# EAGLE design sensors (EAGLE 7.6.0)
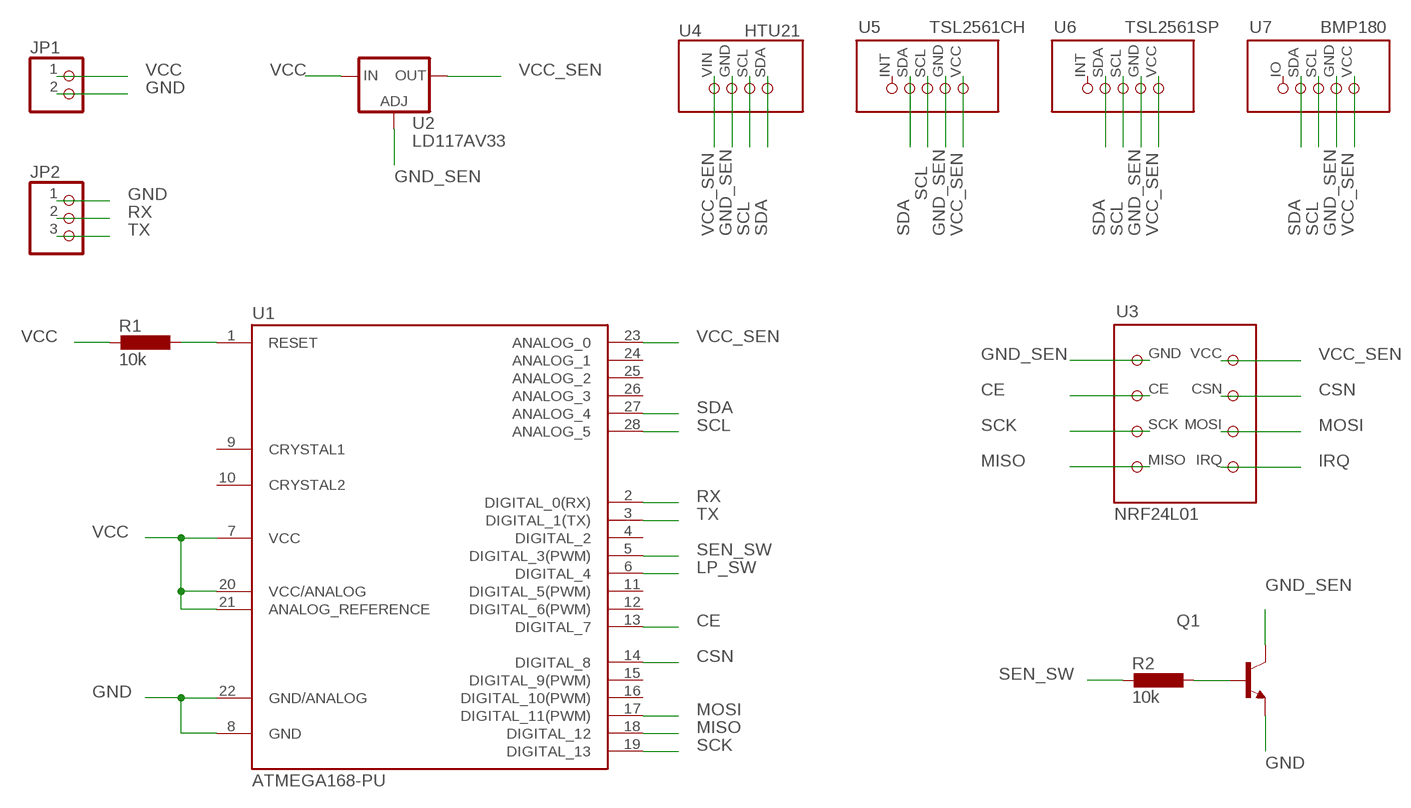
[diagram p0: schematic, sheet 1]

## Parts
JP1  PINHD-1X2  [1X02]
JP2  PINHD-1X3  [1X03]
Q1  -NPN-TO92-EBC  [TO92-EBC]
R1  10k  L-EU0207/10  [0207/10]
R2  10k  L-EU0207/10  [0207/10]
U1  ATMEGA168-PU  [DIL28-3]
U2  LD117AV33  [TO220L1]
U3  NRF24L01  [NRF24L01]
U4  HTU21  [HTU21]
U5  TSL2561CH  [TSL2561-CH]
U6  TSL2561SP  [TSL2561-SP]
U7  BMP180  [BMP180]

## Nets
CE: U1.13(DIGITAL_7) U3.CE
CSN: U1.14(DIGITAL_8) U3.CSN
GND: JP1.2 JP2.1 Q1.E U1.8(GND) U1.22(GND/ANALOG)
GND_SEN: Q1.C U2.1(ADJ) U3.GND U4.GND U5.GND U6.GND U7.GND
IRQ: U3.IRQ
LP_SW: U1.6(DIGITAL_4)
MISO: U1.18(DIGITAL_12) U3.MISO
MOSI: U1.17(DIGITAL_11(PWM)) U3.MOSI
N$1: R1.1 U1.1(RESET)
N$5: Q1.B R2.1
RX: JP2.2 U1.2(DIGITAL_0(RX))
SCK: U1.19(DIGITAL_13) U3.SCK
SCL: U1.28(ANALOG_5) U4.SCL U5.SCL U6.SCL U7.SCL
SDA: U1.27(ANALOG_4) U4.SDA U5.SDA U6.SDA U7.SDA
SEN_SW: R2.2 U1.5(DIGITAL_3(PWM))
TX: JP2.3 U1.3(DIGITAL_1(TX))
VCC: JP1.1 R1.2 U1.7(VCC) U1.20(VCC/ANALOG) U1.21(ANALOG_REFERENCE) U2.3(IN)
VCC_SEN: U1.23(ANALOG_0) U2.2(OUT) U3.VCC U4.VIN U5.VCC U6.VCC U7.VCC
Unconnected: U1.4(DIGITAL_2) U1.9(CRYSTAL1) U1.10(CRYSTAL2) U1.11(DIGITAL_5(PWM)) U1.12(DIGITAL_6(PWM)) U1.15(DIGITAL_9(PWM)) U1.16(DIGITAL_10(PWM)) U1.24(ANALOG_1) U1.25(ANALOG_2) U1.26(ANALOG_3) U5.INT U6.INT U7.IO(INT)

## Library data of the parts
JP1 = pinhead:PINHD-1X2: PIN HEADER
JP2 = pinhead:PINHD-1X3: PIN HEADER
Q1 = transistor:*-NPN-: NPN Transistror BF959 corrected 2008.03.06
R1 R2 = resistor:L-EU: INDUCTOR, European symbol
U1 = Arduino-AVR:ATMEGA168-PU
U2 = v-reg:LD117A?*: Low drop fixed and adjustable positive voltage regulators 1 A Source: http://www.st.com/stonline/products/literature/ds/7194/ld1117axx.pdf
U3 = sencast:NRF24L01
U4 = sencast:HTU21
U5 U6 = sencast:TSL2561
U7 = sencast:BMP180

## Board
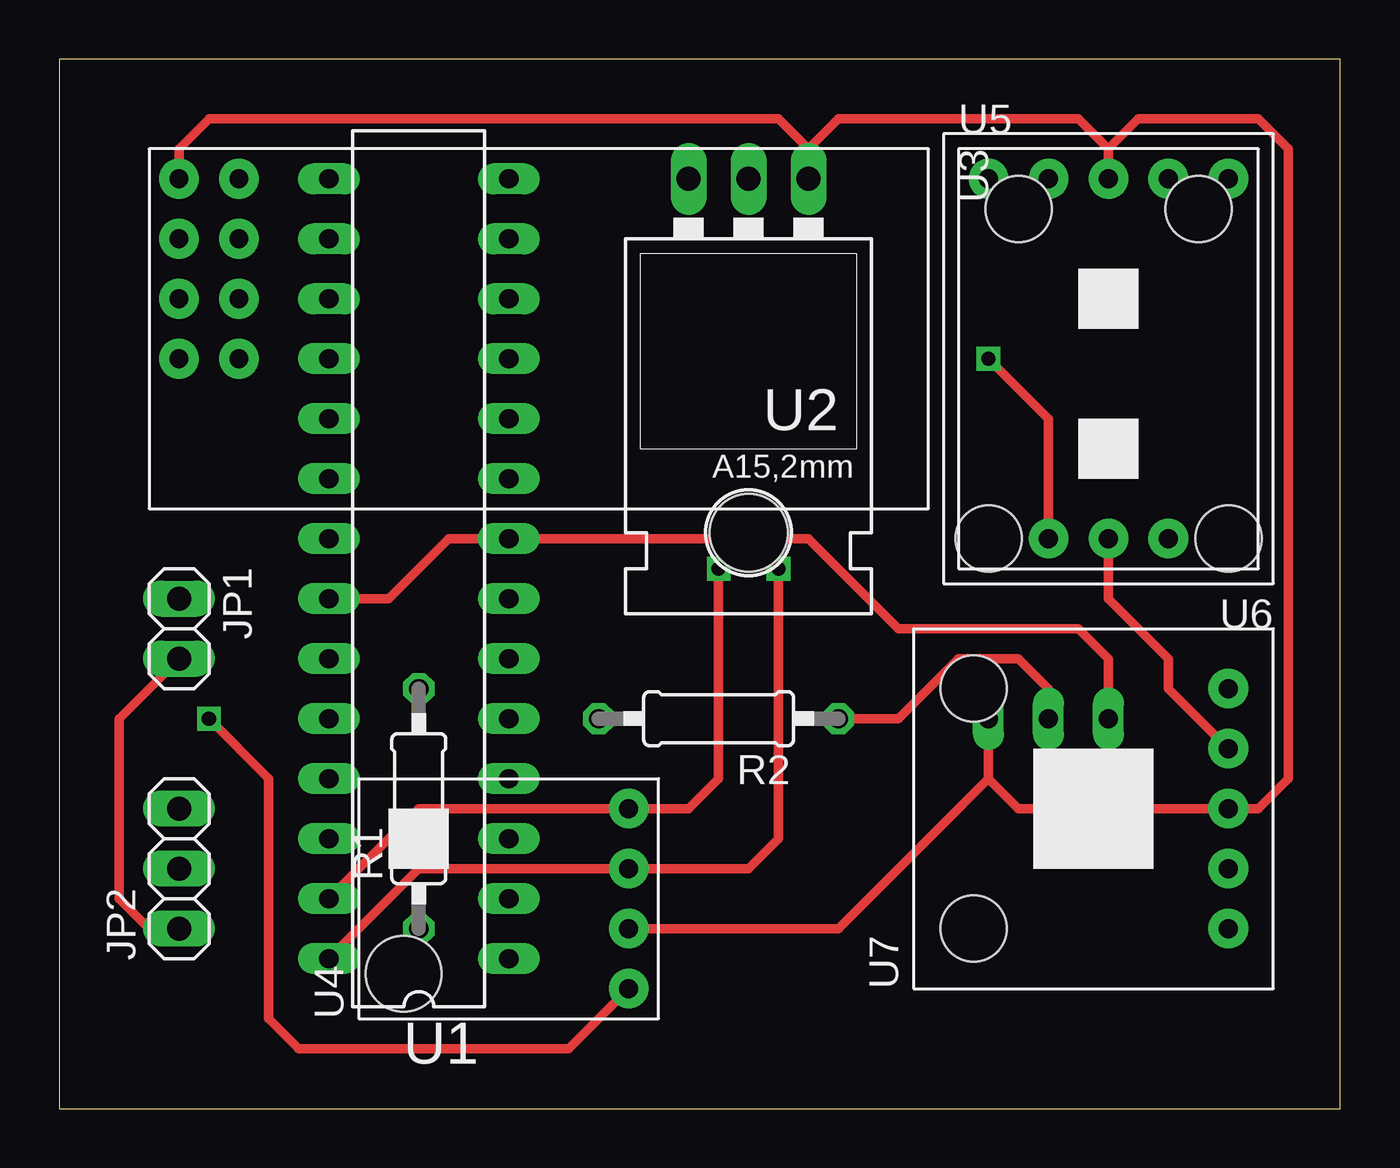
[diagram p1: board, top side]
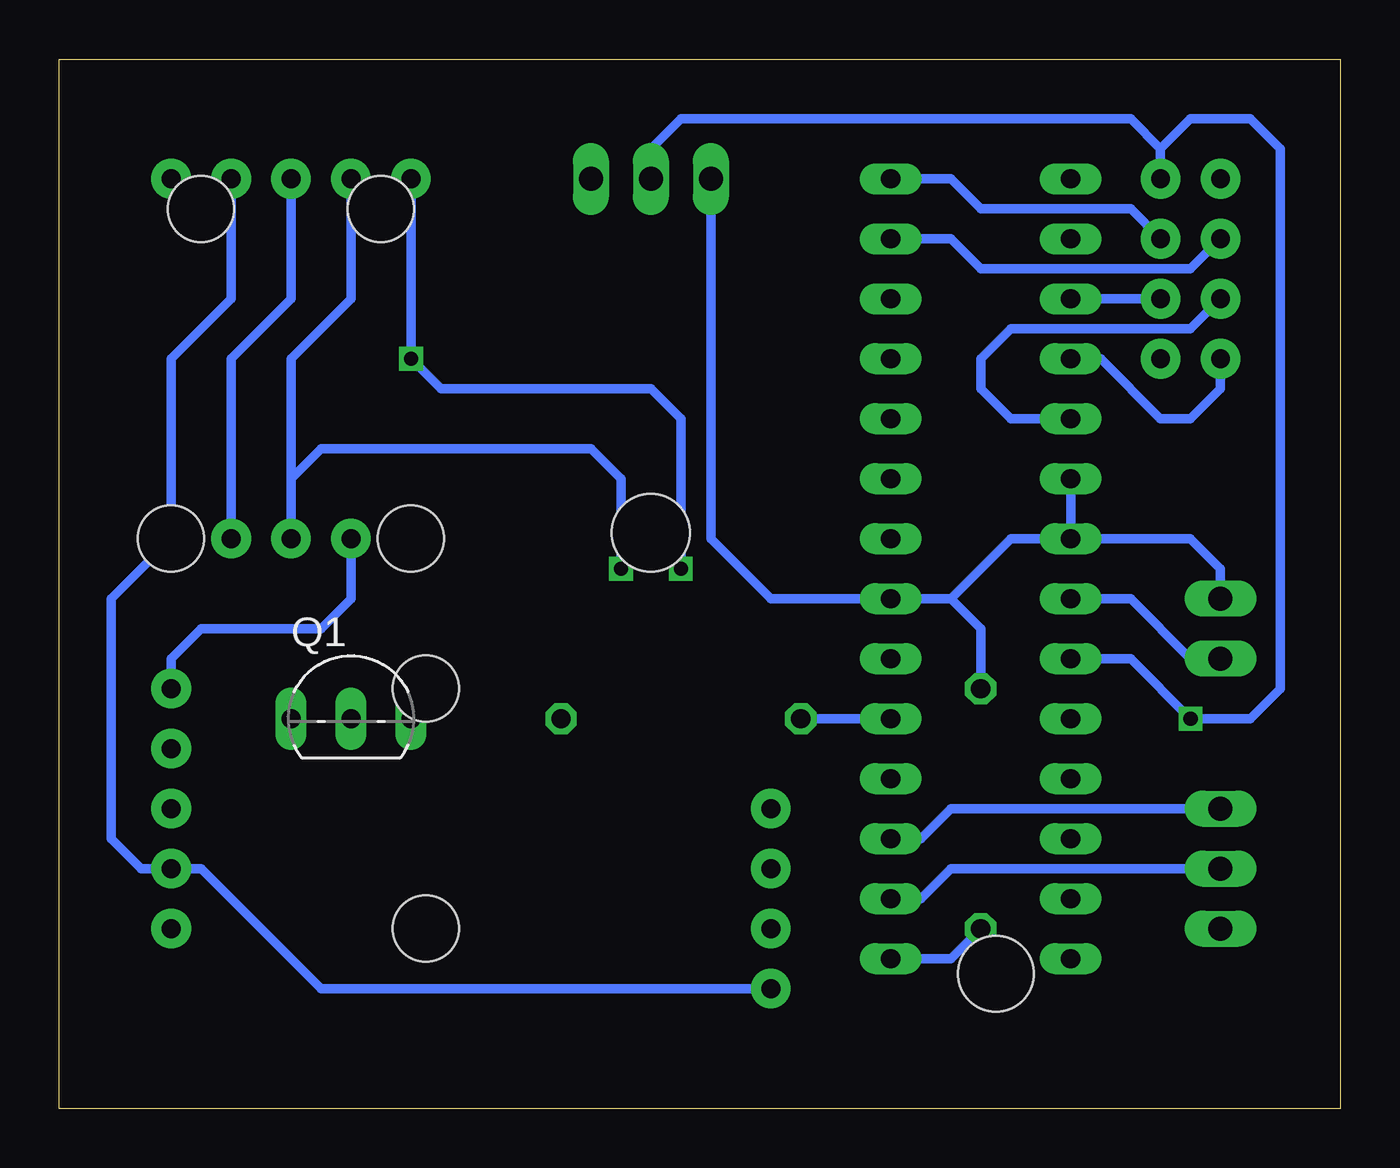
[diagram p2: board, bottom side, seen from below]

Size 54.28 x 44.44 mm. Coordinates in mm from the lower left corner, seen from the top.
Outline: 0,0 54.28,0 54.28,44.44 0,44.44 0,0
Copper layers (1*16): Top 0.035mm / dielectric 1.5mm / Bottom 0.035mm
Design rules "default": minimum track width 10mil, minimum drill 24mil, track to track 8mil, track to pad 8mil, pad to pad 8mil, via to via 8mil, smd to smd 8mil, copper to edge 40mil, drill to drill 8mil, minimum pad ring 10mil, minimum via ring 8mil, stop-mask expansion 4mil, vias tented up to drill 0mil, thermal gap 10mil

### Footprints (pad centres in the part's own frame; a part is rotated, then mirrored left to right if it is on the bottom)
1X02 = drill 1.016 long: 1 -1.27,0; 2 1.27,0
1X03 = drill 1.016 long: 1 -2.54,0; 2 0,0; 3 2.54,0
TO92-EBC = drill 0.813 long: B 0,-1.27; C 2.54,-1.27; E -2.54,-1.27
0207/10 = drill 0.813 octagon: 1 -5.08,0; 2 5.08,0
DIL28-3 = drill 0.813 long: 1 -16.51,-3.81; 2 -13.97,-3.81; 3 -11.43,-3.81; 4 -8.89,-3.81; 5 -6.35,-3.81; 6 -3.81,-3.81; 7 -1.27,-3.81; 8 1.27,-3.81; 9 3.81,-3.81; 10 6.35,-3.81; 11 8.89,-3.81; 12 11.43,-3.81; 13 13.97,-3.81; 14 16.51,-3.81; 15 16.51,3.81; 16 13.97,3.81; 17 11.43,3.81; 18 8.89,3.81; 19 6.35,3.81; 20 3.81,3.81; 21 1.27,3.81; 22 -1.27,3.81; 23 -3.81,3.81; 24 -6.35,3.81; 25 -8.89,3.81; 26 -11.43,3.81; 27 -13.97,3.81; 28 -16.51,3.81
TO220L1 = drill 1.016 long: 1 -2.54,-3.81; 2 0,-3.81; 3 2.54,-3.81 | hole 3.302: 0,11.176
NRF24L01 = drill 0.8 pad 1.676: CE -3.81,-15.24; CSN -3.81,-12.7; GND -6.35,-15.24; IRQ 1.27,-12.7; MISO 1.27,-15.24; MOSI -1.27,-12.7; SCK -1.27,-15.24; VCC -6.35,-12.7
HTU21 = drill 0.8 pad 1.676: GND -1.27,-5.08; SCL 1.27,-5.08; SDA 3.81,-5.08; VIN -3.81,-5.08 | hole 3.2: -3.175,4.445
TSL2561-CH = drill 0.8 pad 1.676: GND 2.54,-7.62; INT -5.08,-7.62; SCL 0,-7.62; SDA -2.54,-7.62; VCC 5.08,-7.62 | hole 2.8: -3.81,6.35; 3.81,6.35
TSL2561-SP = drill 0.8 pad 1.676: GND 0,-7.62; INT -5.08,-7.62; SCL 2.54,-7.62; SDA 5.08,-7.62; VCC -2.54,-7.62 | hole 2.8: -5.08,7.62; 5.08,7.62
BMP180 = drill 0.8 pad 1.676: GND 0,-5.715; IO -5.08,-5.715; SCL 2.54,-5.715; SDA 5.08,-5.715; VCC -2.54,-5.715 | hole 2.8: -5.08,5.08; 5.08,5.08

### Placement (x,y rotation side)
JP1  5.08,20.32 270 top
JP2  5.08,10.16 90 top
Q1  41.91,17.78 0 bottom
R1  15.24,12.7 90 top
R2  27.94,16.51 180 top
U1  15.24,22.86 90 top
U2  29.21,35.56 180 top
U3  20.32,33.02 270 top
U4  19.05,8.89 90 top
U5  44.45,31.75 0 top
U6  44.45,31.75 180 top
U7  43.81,12.7 90 top

### Tracks (layer width: path | path; a pad name or v marks a point on that pad's centre or on a via)
CE
  Bottom 0.406: U3.CE 6.35,35.56 15.24,35.56 16.51,36.83 U1.13
CSN
  Bottom 0.406: U3.CSN 8.89,38.1 15.24,38.1 16.51,39.37 U1.14
GND
  Top 0.406: U1.22 13.97,21.59 16.51,24.13 U1.8 31.75,24.13 35.56,20.32 43.18,20.32 44.45,19.05 Q1.E | JP2.1 3.81,7.62 2.54,8.89 2.54,16.51 JP1.2
  Bottom 0.406: JP1.2 6.35,19.05 8.89,21.59 U1.22
GND_SEN
  Top 0.406: U3.GND 5.08,40.64 6.35,41.91 30.48,41.91 31.75,40.64 | U2.1 31.75,40.64 | 31.75,40.64 33.02,41.91 43.18,41.91 44.45,40.64 | 44.45,40.64 U6.GND | Q1.C 39.37,13.97 | 39.37,13.97 40.64,12.7 U7.GND 50.8,12.7 52.07,13.97 52.07,40.64 50.8,41.91 45.72,41.91 44.45,40.64 | U4.GND 33.02,7.62 39.37,13.97
  Bottom 0.406: U6.GND 44.45,34.29 46.99,31.75 U5.GND
MISO
  Bottom 0.406: U3.MISO 5.08,30.48 6.35,29.21 7.62,29.21 10.16,31.75 U1.18
MOSI
  Bottom 0.406: U3.MOSI U1.17
N$1
  Bottom 0.406: R1.1 16.51,6.35 U1.1
N$5
  Top 0.406: R2.1 35.56,16.51 38.1,19.05 40.64,19.05 41.91,17.78 Q1.B
RX
  Bottom 0.406: U1.2 17.78,8.89 16.51,10.16 JP2.2
SCK
  Bottom 0.406: U3.SCK 6.35,33.02 13.97,33.02 15.24,31.75 15.24,30.48 13.97,29.21 U1.19
SCL  (via drill 0.6)
  Top 0.406: U1.28 15.24,10.16 U4.SCL 29.21,10.16 30.48,11.43 v30.48,22.86 | U7.SCL 46.99,17.78 46.99,19.05 44.45,21.59 U5.SCL
  Bottom 0.406: v30.48,22.86 30.48,26.67 31.75,27.94 43.18,27.94 44.45,26.67 | 44.45,26.67 U5.SCL | U6.SCL 41.91,34.29 44.45,31.75 44.45,26.67
SDA  (via drill 0.6)
  Top 0.406: U1.27 15.24,12.7 U4.SDA 26.67,12.7 27.94,13.97 v27.94,22.86 | v39.37,31.75 41.91,29.21 U5.SDA
  Bottom 0.406: U7.SDA 49.53,19.05 48.26,20.32 43.18,20.32 41.91,21.59 U5.SDA | v27.94,22.86 27.94,29.21 29.21,30.48 38.1,30.48 v39.37,31.75 U6.SDA
SEN_SW
  Bottom 0.406: U1.5 R2.2
TX
  Bottom 0.406: U1.3 17.78,11.43 16.51,12.7 JP2.3
VCC
  Bottom 0.406: JP1.1 5.08,22.86 6.35,24.13 U1.21 | U1.21 13.97,24.13 16.51,21.59 | 16.51,21.59 U1.7 24.13,21.59 26.67,24.13 U2.3 | U1.21 U1.20 | R1.2 15.24,20.32 16.51,21.59
VCC_SEN  (via drill 0.6)
  Top 0.406: U4.VIN 21.59,2.54 10.16,2.54 8.89,3.81 8.89,13.97 v6.35,16.51
  Bottom 0.406: 7.62,40.64 8.89,41.91 27.94,41.91 29.21,40.64 U2.2 | U3.VCC 7.62,40.64 | 7.62,40.64 6.35,41.91 3.81,41.91 2.54,40.64 2.54,17.78 3.81,16.51 v6.35,16.51 8.89,19.05 U1.23 | U6.VCC 46.99,34.29 49.53,31.75 U5.VCC 52.07,21.59 52.07,11.43 50.8,10.16 U7.VCC 48.26,10.16 43.18,5.08 U4.VIN